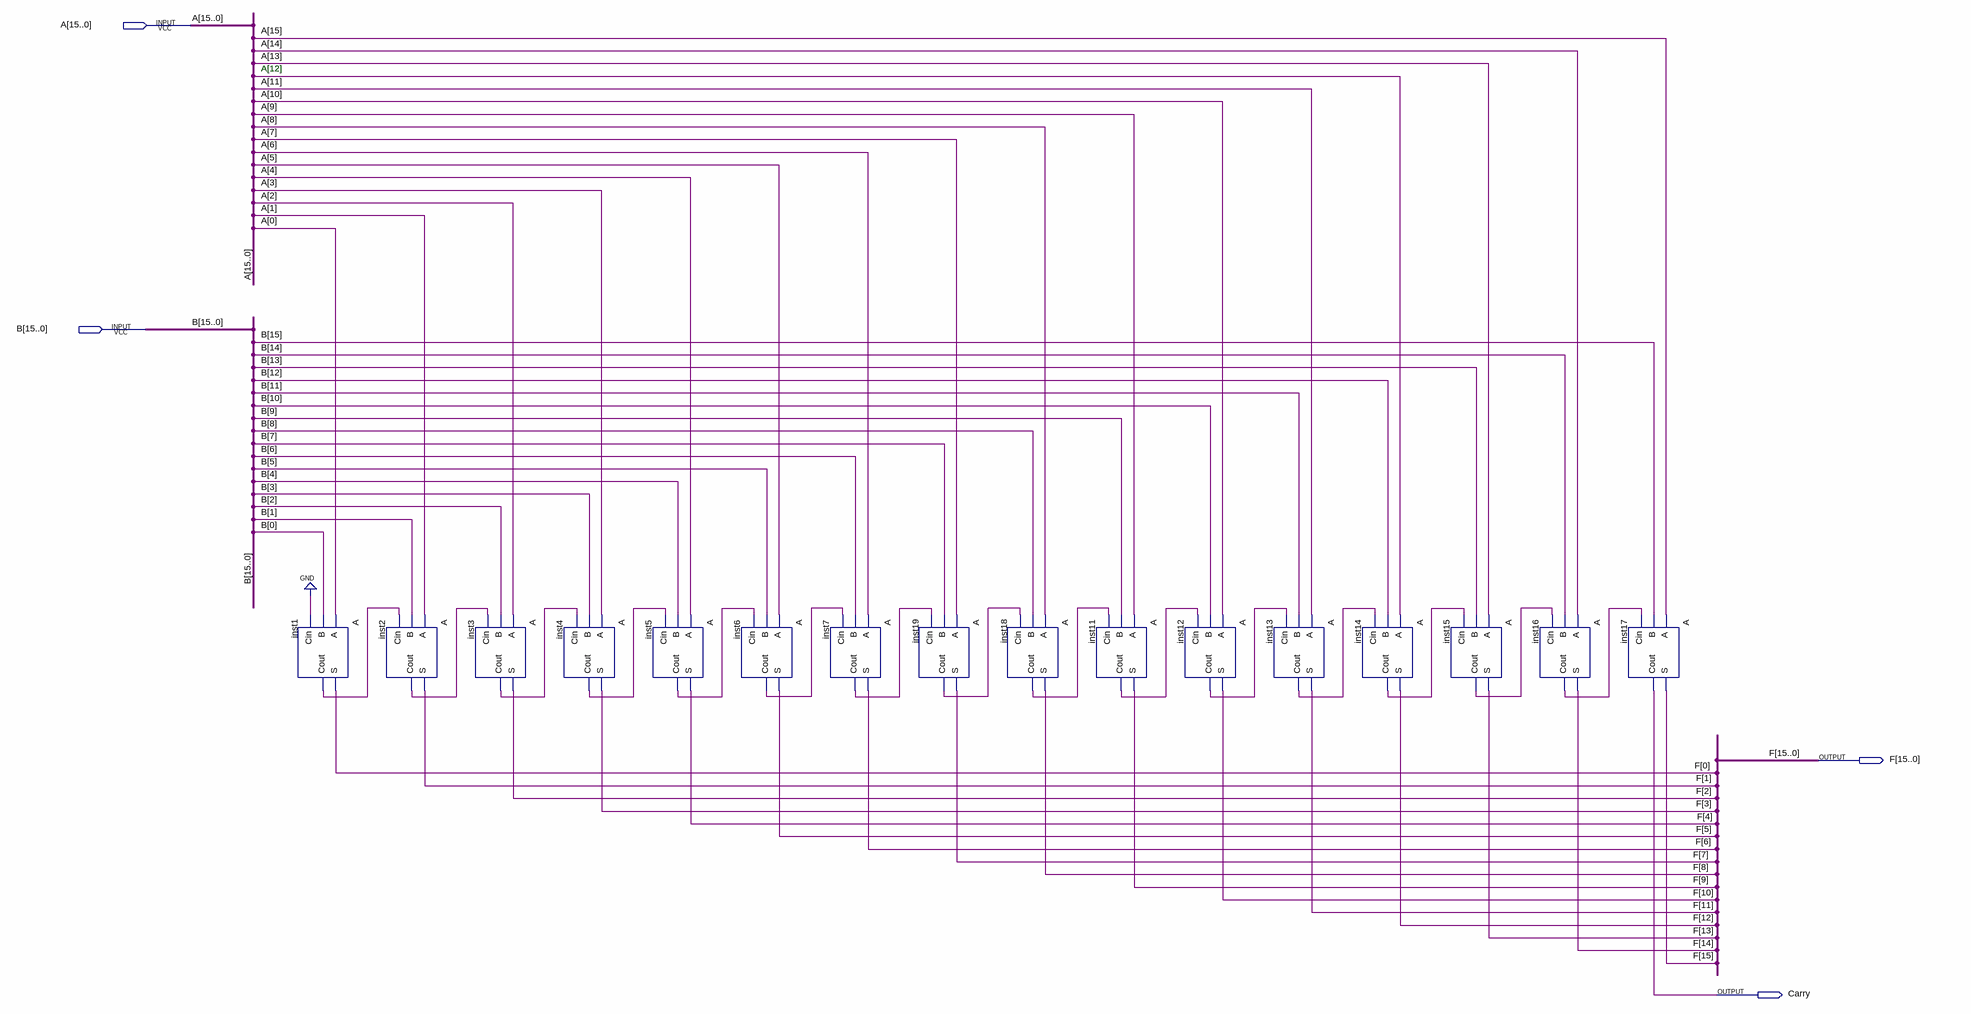
[diagram p0: schematic sheet]
// Quartus schematic AcongB.bdf as structural Verilog: 16 symbols, 4 pins
module AcongB (
  input  [15:0] A,
  input  [15:0] B,
  output [15:0] F,
  output Carry
);

  wire inst1_cout, inst2_cout, inst3_cout, inst4_cout, inst5_cout, inst6_cout, inst7_cout, inst11_cout,
       inst12_cout, inst13_cout, inst14_cout, inst15_cout, inst16_cout, inst18_cout, inst19_cout;

  A inst1 (.A(A[0]), .B(B[0]), .Cin(1'b0), .S(F[0]), .Cout(inst1_cout));
  A inst2 (.A(A[1]), .B(B[1]), .Cin(inst1_cout), .S(F[1]), .Cout(inst2_cout));
  A inst3 (.A(A[2]), .B(B[2]), .Cin(inst2_cout), .S(F[2]), .Cout(inst3_cout));
  A inst4 (.A(A[3]), .B(B[3]), .Cin(inst3_cout), .S(F[3]), .Cout(inst4_cout));
  A inst5 (.A(A[4]), .B(B[4]), .Cin(inst4_cout), .S(F[4]), .Cout(inst5_cout));
  A inst6 (.A(A[5]), .B(B[5]), .Cin(inst5_cout), .S(F[5]), .Cout(inst6_cout));
  A inst7 (.A(A[6]), .B(B[6]), .Cin(inst6_cout), .S(F[6]), .Cout(inst7_cout));
  A inst19 (.A(A[7]), .B(B[7]), .Cin(inst7_cout), .S(F[7]), .Cout(inst19_cout));
  A inst18 (.A(A[8]), .B(B[8]), .Cin(inst19_cout), .S(F[8]), .Cout(inst18_cout));
  A inst11 (.A(A[9]), .B(B[9]), .Cin(inst18_cout), .S(F[9]), .Cout(inst11_cout));
  A inst12 (.A(A[10]), .B(B[10]), .Cin(inst11_cout), .S(F[10]), .Cout(inst12_cout));
  A inst13 (.A(A[11]), .B(B[11]), .Cin(inst12_cout), .S(F[11]), .Cout(inst13_cout));
  A inst14 (.A(A[12]), .B(B[12]), .Cin(inst13_cout), .S(F[12]), .Cout(inst14_cout));
  A inst15 (.A(A[13]), .B(B[13]), .Cin(inst14_cout), .S(F[13]), .Cout(inst15_cout));
  A inst16 (.A(A[14]), .B(B[14]), .Cin(inst15_cout), .S(F[14]), .Cout(inst16_cout));
  A inst17 (.A(A[15]), .B(B[15]), .Cin(inst16_cout), .S(F[15]), .Cout(Carry));

  // Notes on the sheet:
  //   A[12]
endmodule
